# Altium schematic sheet Top.SchDoc
size A
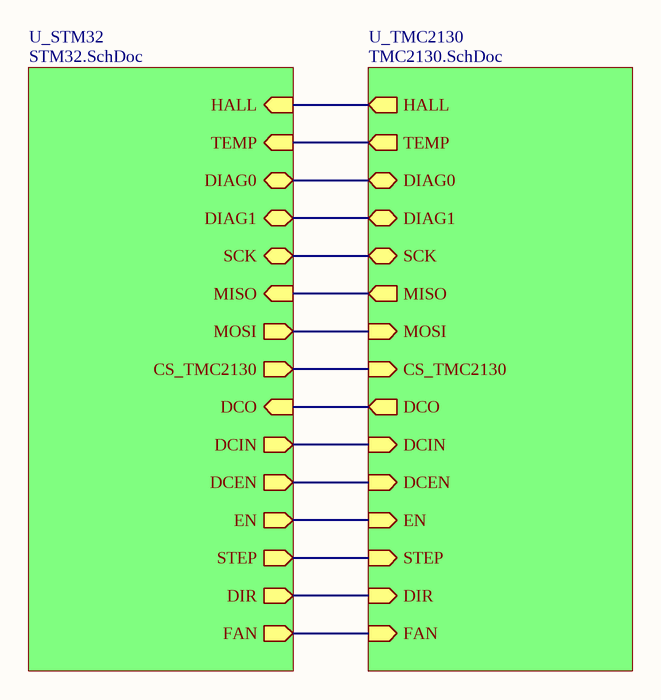
[diagram p0: Top.SchDoc]

## Sub-sheets
U_STM32 = STM32.SchDoc: CS_TMC2130 (out), DIR (out), MISO (in), MOSI (out), SCK (bidir), EN (out), DIAG0 (bidir), HALL (in), DCO (in), DCEN (out), TEMP (in), DIAG1 (bidir), DCIN (out), STEP (out), FAN (out)
U_TMC2130 = TMC2130.SchDoc: DIAG1 (bidir), DIAG0 (bidir), DCO (out), DCIN (in), TEMP (out), HALL (out), DCEN (in), MOSI (in), SCK (bidir), MISO (out), STEP (in), DIR (in), EN (in), CS_TMC2130 (in), FAN (in)

## Nets
(unnamed): sheet U_STM32/CS_TMC2130, sheet U_TMC2130/CS_TMC2130
(unnamed): sheet U_STM32/DIR, sheet U_TMC2130/DIR
(unnamed): sheet U_STM32/MISO, sheet U_TMC2130/MISO
(unnamed): sheet U_STM32/MOSI, sheet U_TMC2130/MOSI
(unnamed): sheet U_STM32/SCK, sheet U_TMC2130/SCK
(unnamed): sheet U_STM32/EN, sheet U_TMC2130/EN
(unnamed): sheet U_STM32/DIAG0, sheet U_TMC2130/DIAG0
(unnamed): sheet U_STM32/HALL, sheet U_TMC2130/HALL
(unnamed): sheet U_STM32/DCO, sheet U_TMC2130/DCO
(unnamed): sheet U_STM32/DCEN, sheet U_TMC2130/DCEN
(unnamed): sheet U_STM32/TEMP, sheet U_TMC2130/TEMP
(unnamed): sheet U_STM32/DIAG1, sheet U_TMC2130/DIAG1
(unnamed): sheet U_STM32/DCIN, sheet U_TMC2130/DCIN
(unnamed): sheet U_STM32/STEP, sheet U_TMC2130/STEP
(unnamed): sheet U_STM32/FAN, sheet U_TMC2130/FAN